# Altium schematic sheet MainBoard_V1p0_MCU.SchDoc
size A4; SheetNumber: 3; SheetTotal: 8
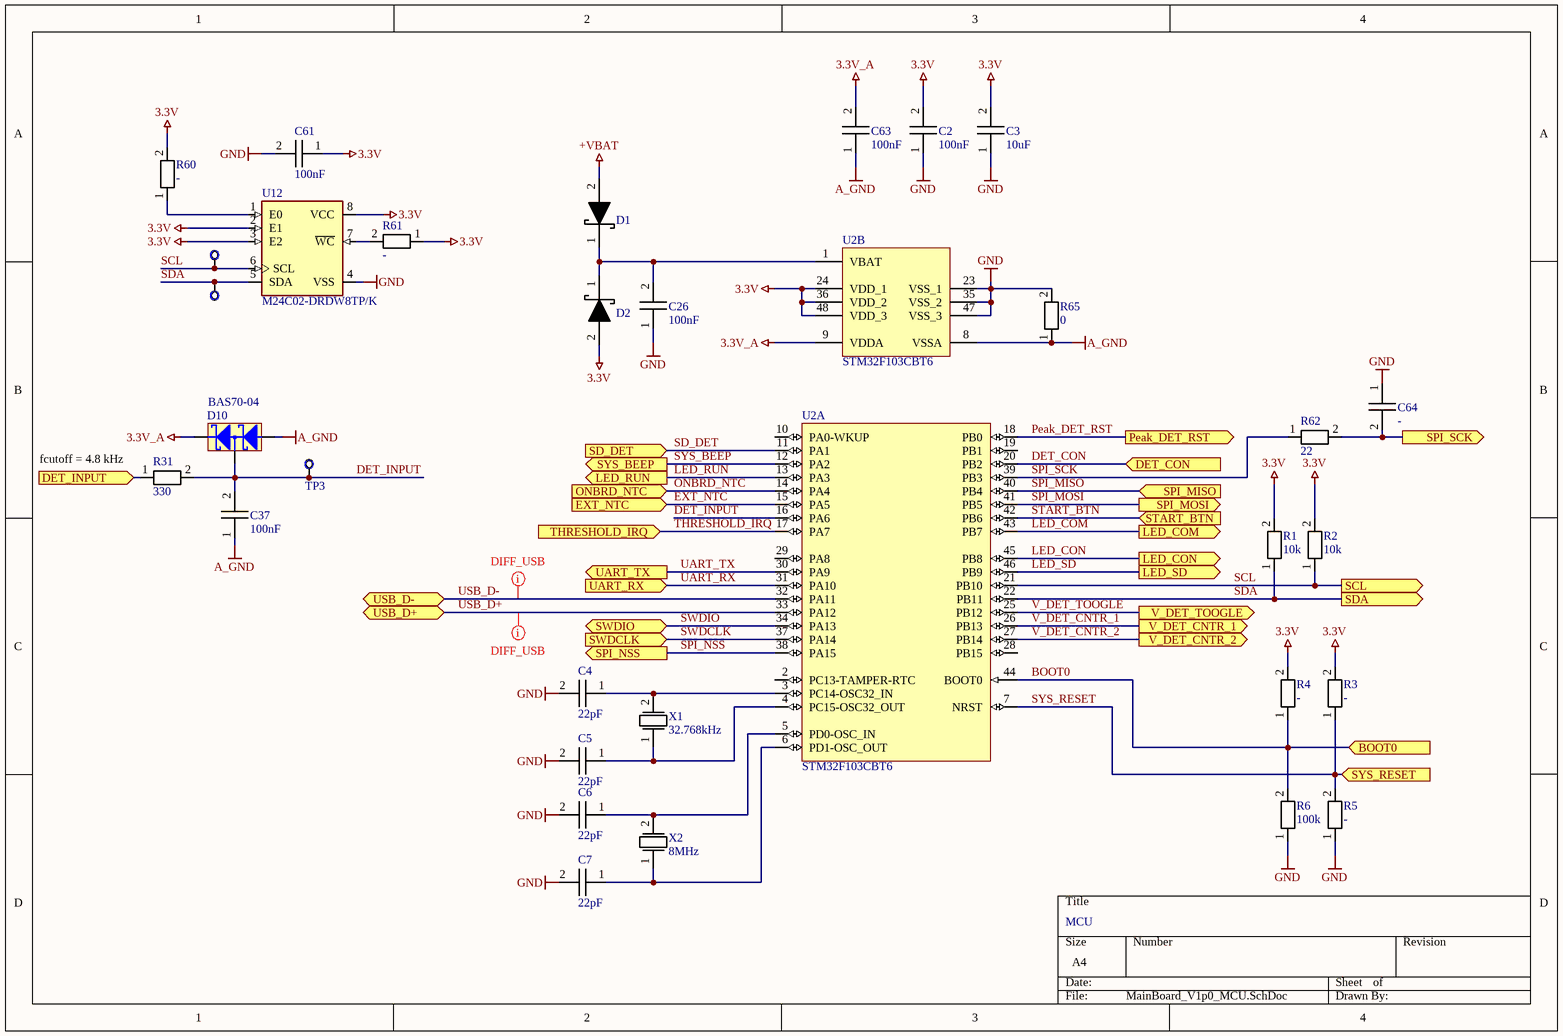
[diagram p0: MainBoard_V1p0_MCU.SchDoc]

## Parts
C2  100nF  [0805_C]
C3  10uF  [1210_C]
C4  22pF  [0805_C]
C5  22pF  [0805_C]
C6  22pF  [0805_C]
C7  22pF  [0805_C]
C26  100nF  [0805_C]
C37  100nF  [0805_C]
C61  100nF  [0805_C]
C63  100nF  [0805_C]
C64  -  [0805_C]
D1  DIODE_SCHOTTKY  [SMD_DIODE_SOD80]  (value not drawn)
D2  DIODE_SCHOTTKY  [SMD_DIODE_SOD80]  (value not drawn)
D10  BAS70-04  [SOT23]
R1  10k  [0805]
R2  10k  [0805]
R3  -  [0805]
R4  -  [0805]
R5  -  [0805]
R6  100k  [0805]
R31  330  [0805]
R60  -  [0805]
R61  -  [0805]
R62  22  [0805]
R65  0  [0805]
TP1  ?  [PAD_40]  (value not drawn)  (no BOM)
TP2  ?  [PAD_40]  (value not drawn)  (no BOM)
TP3  ?  [PAD_40]  (value not drawn)  (no BOM)
U2  STM32F103CBT6  [STM-LQFP48_N]  (parts A,B of 2)
U12  M24C02-DRDW8TP/K  [TSSOP8]
X1  32.768kHz  [XTAL_SMALL]
X2  8MHz  [XTAL_SMALL]

## Ports
BOOT0 (in), DET_CON (in), DET_INPUT (in), EXT_NTC (in), LED_COM (out), LED_CON (out), LED_RUN (out), LED_SD (out), ONBRD_NTC (in), Peak_DET_RST (out), SCL (out), SD_DET (in), SDA (out), SPI_MISO (in), SPI_MOSI (out), SPI_NSS (out), SPI_SCK (out), START_BTN (in), SWDCLK (in), SWDIO (bidir), SYS_BEEP (out), SYS_RESET (in), THRESHOLD_IRQ (in), UART_RX (in), UART_TX (out), USB_D+ (bidir), USB_D- (bidir), V_DET_CNTR_1 (out), V_DET_CNTR_2 (out), V_DET_TOOGLE (out)

## Nets
3.3V: C2.2 C3.2 C61.1 D2.2 R1.2 R2.2 R3.2 R4.2 R60.2 R61.1 U2.24(VDD_1) U2.36(VDD_2) U2.48(VDD_3) U12.2(E1) U12.3(E2) U12.8(VCC)
3.3V_A: C63.2 D10.2 U2.9(VDDA)
+VBAT: D1.2
A_GND: C37.1 C63.1 D10.1 R65.1 U2.8(VSSA)
GND: C2.1 C3.1 C4.2 C5.2 C6.2 C7.2 C26.1 C61.2 C64.1 R5.1 R6.1 R65.2 U2.23(VSS_1) U2.35(VSS_2) U2.47(VSS_3) U12.4(VSS)
BOOT0: R4.1 R6.2 U2.44(BOOT0) ; port BOOT0
DET_CON: U2.20(PB2) ; port DET_CON
DET_INPUT: C37.2 D10.3 R31.2 TP3.1 U2.16(PA6)
DET_INPUT: R31.1 ; port DET_INPUT  [a separate net that carries the same name]
EXT_NTC: U2.15(PA5) ; port EXT_NTC
LED_COM: U2.43(PB7) ; port LED_COM
LED_CON: U2.45(PB8) ; port LED_CON
LED_RUN: U2.13(PA3) ; port LED_RUN
LED_SD: U2.46(PB9) ; port LED_SD
ONBRD_NTC: U2.14(PA4) ; port ONBRD_NTC
Peak_DET_RST: U2.18(PB0) ; port Peak_DET_RST
SCL: R2.1 TP1.1 U2.21(PB10) U12.6(SCL) ; port SCL
SD_DET: U2.11(PA1) ; port SD_DET
SDA: R1.1 TP2.1 U2.22(PB11) U12.5(SDA) ; port SDA
SPI_MISO: U2.40(PB4) ; port SPI_MISO
SPI_MOSI: U2.41(PB5) ; port SPI_MOSI
SPI_NSS: U2.38(PA15) ; port SPI_NSS
SPI_SCK: R62.1 U2.39(PB3)
SPI_SCK: C64.2 R62.2 ; port SPI_SCK  [a separate net that carries the same name]
START_BTN: U2.42(PB6) ; port START_BTN
SWDCLK: U2.37(PA14) ; port SWDCLK
SWDIO: U2.34(PA13) ; port SWDIO
SYS_BEEP: U2.12(PA2) ; port SYS_BEEP
SYS_RESET: R3.1 R5.2 U2.7(NRST) ; port SYS_RESET
THRESHOLD_IRQ: U2.17(PA7) ; port THRESHOLD_IRQ
UART_RX: U2.31(PA10) ; port UART_RX
UART_TX: U2.30(PA9) ; port UART_TX
USB_D+: U2.33(PA12) ; port USB_D+
USB_D-: U2.32(PA11) ; port USB_D-
V_DET_CNTR_1: U2.26(PB13) ; port V_DET_CNTR_1
V_DET_CNTR_2: U2.27(PB14) ; port V_DET_CNTR_2
V_DET_TOOGLE: U2.25(PB12) ; port V_DET_TOOGLE
NetC4_1: C4.1 U2.3(PC14-OSC32_IN) X1.2
NetC5_1: C5.1 U2.4(PC15-OSC32_OUT) X1.1
NetC6_1: C6.1 U2.5(PD0-OSC_IN) X2.2
NetC7_1: C7.1 U2.6(PD1-OSC_OUT) X2.1
NetC26_2: C26.2 D1.1 D2.1 U2.1(VBAT)
NetR60_1: R60.1 U12.1(E0)
NetR61_2: R61.2 U12.7(~{WC})

Not connected (* = marked no-connect by the designer): U2 2(PC13-TAMPER-RTC) 10(PA0-WKUP) 19(PB1) 28(PB15) 29(PA8)

## Layout directives
net class D90: USB_D+, USB_D-

## Notes on the sheet
- (near R31) fcutoff = 4.8 kHz
- MCU

## Library data of the parts
C2-C7 C26 C37 C61 C63 C64 = CAPACITOR
R1 R2 = RESISTOR: Parameter 1: 10k
R3-R6 R31 R60-R62 R65 = RESISTOR: Parameter 1: 10k
TP1-TP3 = TESTPOINT
U2 = STM32F103CBT6: ARM Cortex-M3 32-bit MCU, 128 KB Flash, 20 KB Internal RAM, 37 I/Os, 48-pin LQFP, -40 to 85 degC, Tray; Supply Voltage(Vcc) min (V): 2; Operating Frequency(F) (Processor speed) (MHz): 72; A/D Converter: 2x12-bit (10 Channel); FLASH Size (Prog) (kB): 128; Internal RAM Size (kB): 20; I/Os (High Current): 37; ComponentLink2Description: Datasheet; PackageReference: LQFP48; PartNumber: STM32F103CBT6; ComponentLink1Description: Manufacturer URL; DatasheetVersion: Rev. 16; PackageVersion: Rev. 6, 06/2013; Packing: Tray; ComponentLink1URL: http://www.st.com/web/en/home.html; Mounting Technology: Surface Mount; ComponentLink3URL: http://www.st.com/st-web-ui/static/active/en/resource/technical/document/datasheet/DM00058181.pdf; PackageDescription: 48-Pin Low Profile Quad Flat Package, 7 x 7 mm Body, 0.5 mm Pitch; Core: ARM Cortex-M3; ComponentLink3Description: Package Specification; ComponentLink2URL: http://www.st.com/st-web-ui/static/active/en/resource/technical/document/datasheet/CD00161566.pdf
U12 = M24C02-FDW6TP: EEPROM Memory IC 2Kb (256 x 8) I2C 400kHz 900ns 8-TSSOP; MF: STMicroelectronics; Package: TSSOP-8 STMicroelectronics; MP: M24C02-FDW6TP; Digi-Key_Part_Number: 497-15746-1-ND; Value: *; SnapEDA_Link: https://www.snapeda.com/parts/M24C02-FDW6TP/STMicroelectronics/view-part/1102461/?ref=snap
X1 X2 = XTAL